# Altium schematic sheet GPS_Traking_V1_3.SchDoc: GPS_Tracking
size A4
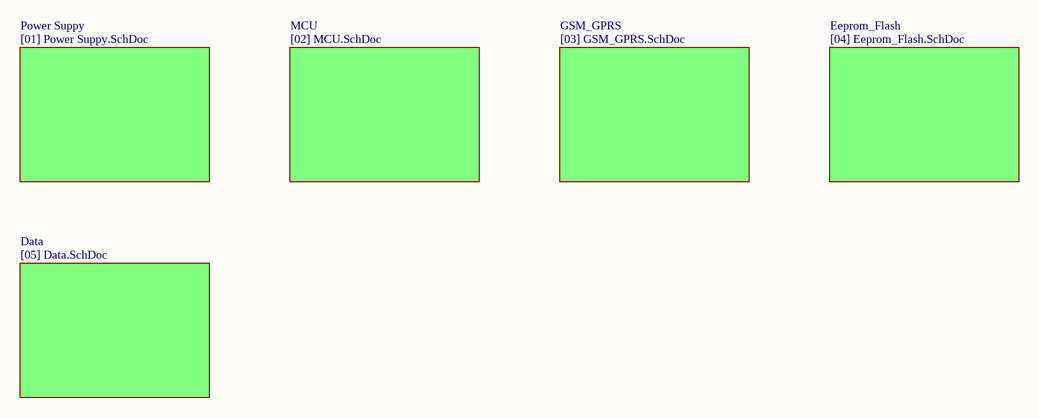
[diagram p0: GPS_Traking_V1_3.SchDoc]

## Sub-sheets
Data = [05] Data.SchDoc: no entries
Eeprom_Flash = [04] Eeprom_Flash.SchDoc: no entries
GSM_GPRS = [03] GSM_GPRS.SchDoc: no entries
MCU = [02] MCU.SchDoc: no entries
Power Suppy = [01] Power Suppy.SchDoc: no entries

## Notes on the sheet
- Title
- Size:
- Date:
- A4
- Number:
- Time:
- Revision:
- Sheet
- of
- File: